# Altium project Universal receiver_Project.PrjPcb
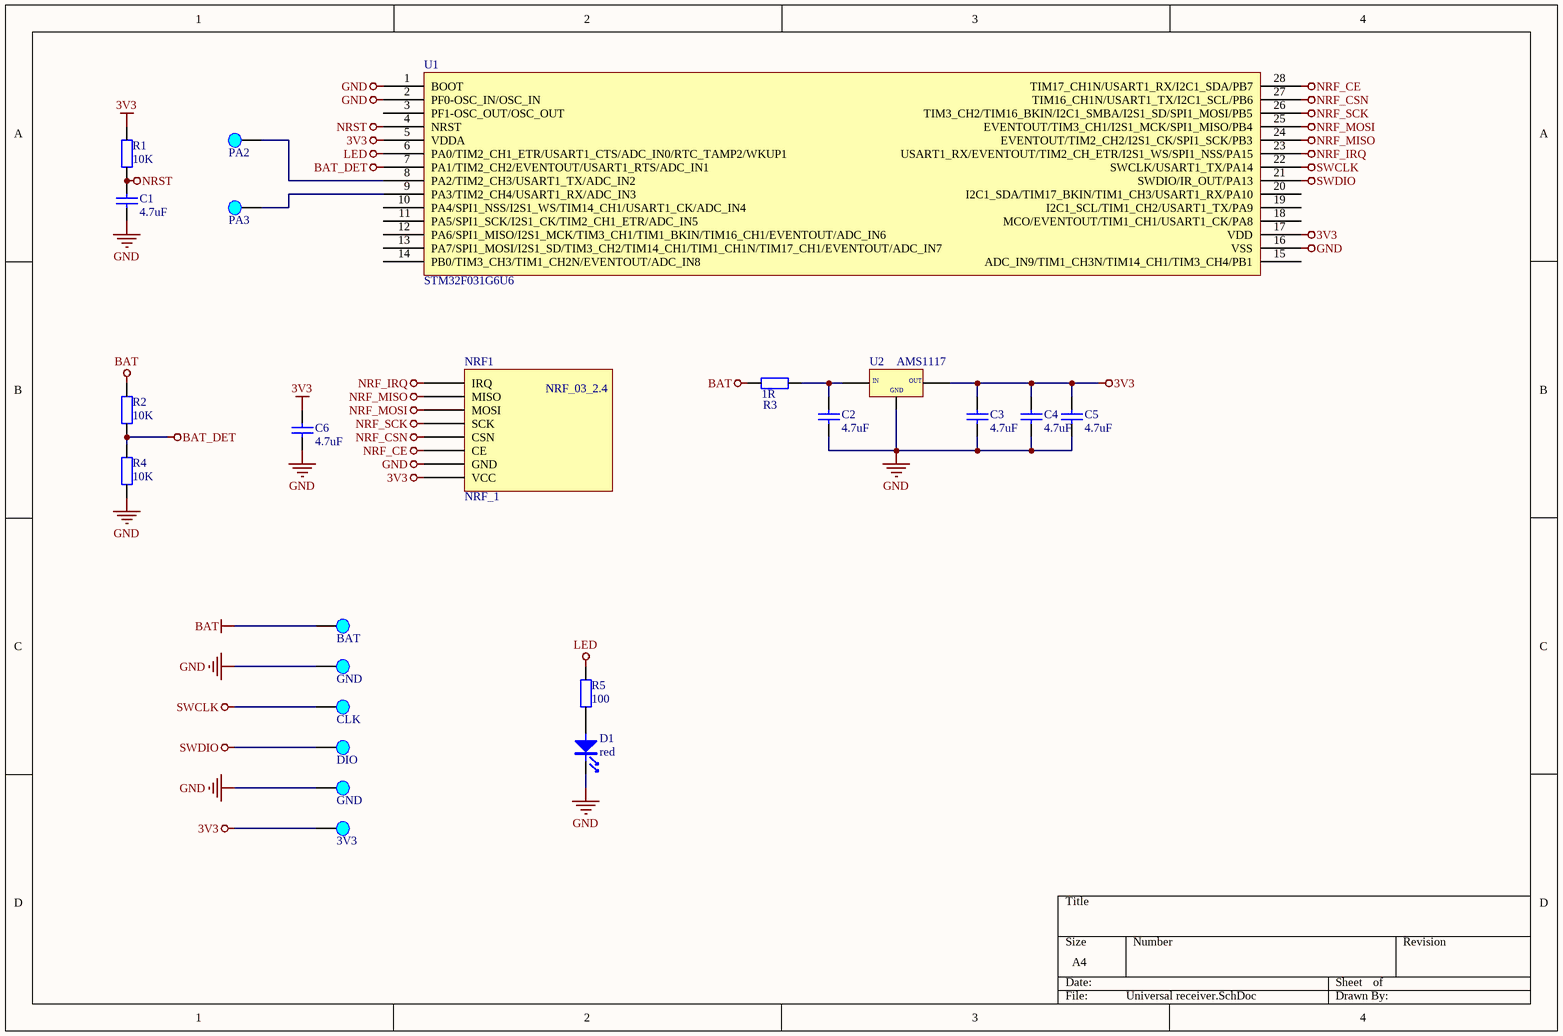
[diagram p0: Universal receiver.SchDoc]
1 sheet, 23 parts. Net scope: global (net labels, ports and power ports of the same name join across sheets).
Board file: Universal receiver.PcbDoc

## Sheet Universal receiver.SchDoc
size A4

### Parts
1  3V3  [Pad_B]
BAT1  BAT  [Pad_B]
C1  4.7uF  [电容_C0603]
C2  4.7uF  [电容_C0603]
C3  4.7uF  [电容_C0603]
C4  4.7uF  [电容_C0603]
C5  4.7uF  [电容_C0603]
C6  4.7uF  [电容_C0603]
CLK1  CLK  [Pad_B]
D1  red  [LED_0603]
DIO1  DIO  [Pad_B]
GND1  GND  [Pad_B]
GND2  GND  [Pad_B]
NRF1  NRF_1  [NRF-1]
PA1  PA2  [Pad_B]
PA2  PA3  [Pad_B]
R1  10K  [电阻_R0603]
R2  10K  [电阻_R0603]
R3  1R  [电阻_R0603]
R4  10K  [电阻_R0603]
R5  100  [电阻_R0603]
U1  STM32F031G6U6  [ST主控_UFQFPN28]
U2  AMS1117  [稳压芯片_SOT-89]

### Nets
3V3: 1.1 C3.2 C4.2 C5.2 C6.2 NRF1.1(VCC) R1.2 U1.5(VDDA) U1.17(VDD) U2.2(OUT)
BAT: BAT1.1 R2.2 R3.1
BAT_DET: R2.1 R4.2 U1.7(PA1/TIM2_CH2/EVENTOUT/USART1_RTS/ADC_IN1)
GND: C1.1 C2.1 C3.1 C4.1 C5.1 C6.1 D1.K GND1.1 GND2.1 NRF1.2(GND) R4.1 U1.1(BOOT) U1.2(PF0-OSC_IN/OSC_IN) U1.16(VSS) U2.1(GND)
LED: R5.1 U1.6(PA0/TIM2_CH1_ETR/USART1_CTS/ADC_IN0/RTC_TAMP2/WKUP1)
NRF_CE: NRF1.3(CE) U1.28(TIM17_CH1N/USART1_RX/I2C1_SDA/PB7)
NRF_CSN: NRF1.4(CSN) U1.27(TIM16_CH1N/USART1_TX/I2C1_SCL/PB6)
NRF_IRQ: NRF1.8(IRQ) U1.23(USART1_RX/EVENTOUT/TIM2_CH_ETR/I2S1_WS/SPI1_NSS/PA15)
NRF_MISO: NRF1.7(MISO) U1.24(EVENTOUT/TIM2_CH2/I2S1_CK/SPI1_SCK/PB3)
NRF_MOSI: NRF1.6(MOSI) U1.25(EVENTOUT/TIM3_CH1/I2S1_MCK/SPI1_MISO/PB4)
NRF_SCK: NRF1.5(SCK) U1.26(TIM3_CH2/TIM16_BKIN/I2C1_SMBA/I2S1_SD/SPI1_MOSI/PB5)
NRST: C1.2 R1.1 U1.4(NRST)
SWCLK: CLK1.1 U1.22(SWCLK/USART1_TX/PA14)
SWDIO: DIO1.1 U1.21(SWDIO/IR_OUT/PA13)
NetC2_2: C2.2 R3.2 U2.3(VIN)
NetD1_A: D1.A R5.2
NetPA1_1: PA1.1 U1.8(PA2/TIM2_CH3/USART1_TX/ADC_IN2)
NetPA2_1: PA2.1 U1.9(PA3/TIM2_CH4/USART1_RX/ADC_IN3)

Not connected (* = marked no-connect by the designer): U1 3(PF1-OSC_OUT/OSC_OUT) 10(PA4/SPI1_NSS/I2S1_WS/TIM14_CH1/USART1_CK/ADC_IN4) 11(PA5/SPI1_SCK/I2S1_CK/TIM2_CH1_ETR/ADC_IN5) 12(PA6/SPI1_MISO/I2S1_MCK/TIM3_CH1/TIM1_BKIN/TIM16_CH1/EVENTOUT/ADC_IN6) 13(PA7/SPI1_MOSI/I2S1_SD/TIM3_CH2/TIM14_CH1/TIM1_CH1N/TIM17_CH1/EVENTOUT/ADC_IN7) 14(PB0/TIM3_CH3/TIM1_CH2N/EVENTOUT/ADC_IN8) 15(ADC_IN9/TIM1_CH3N/TIM14_CH1/TIM3_CH4/PB1) 18(MCO/EVENTOUT/TIM1_CH1/USART1_CK/PA8) 19(I2C1_SCL/TIM1_CH2/USART1_TX/PA9) 20(I2C1_SDA/TIM17_BKIN/TIM1_CH3/USART1_RX/PA10)

### Notes on the sheet
- (in symbol AMS1117) IN
- (in symbol NRF_1) NRF_03_2.4

### Library data of the parts
1 = Pad: _Funcyusa: Test; _Specification: Pad,Test,3V3; _Comma: ,; _Name: Pad; _Remarks: 3V3
BAT1 = Pad: _Funcyusa: Test; _Specification: Pad,Test,BAT; _Comma: ,; _Name: Pad; _Remarks: BAT
C1-C6 = cap: U: 50V; 参数: Cap,0805,X7R,104K,50V,125C,±10%; C: 4.7uF
CLK1 = Pad: _Funcyusa: Test; _Specification: Pad,Test,CLK; _Comma: ,; _Name: Pad; _Remarks: CLK
D1 = LED: 参数: LED,0603,Red
DIO1 = Pad: _Funcyusa: Test; _Specification: Pad,Test,DIO; _Comma: ,; _Name: Pad; _Remarks: DIO
GND1 GND2 = Pad: _Funcyusa: Test; _Specification: Pad,Test,GND; _Comma: ,; _Name: Pad; _Remarks: GND
PA1 = Pad: _Funcyusa: Test; _Specification: Pad,Test,PA2; _Comma: ,; _Name: Pad; _Remarks: PA2
PA2 = Pad: _Funcyusa: Test; _Specification: Pad,Test,PA3; _Comma: ,; _Name: Pad; _Remarks: PA3
R1-R5 = Res: P: 1/8W; 参数: Res,0805,0R,±1%,1/8W,100ppm,155C
  R1 R2 R4: R: 10K
  R3: R: 1R
  R5: R: 100